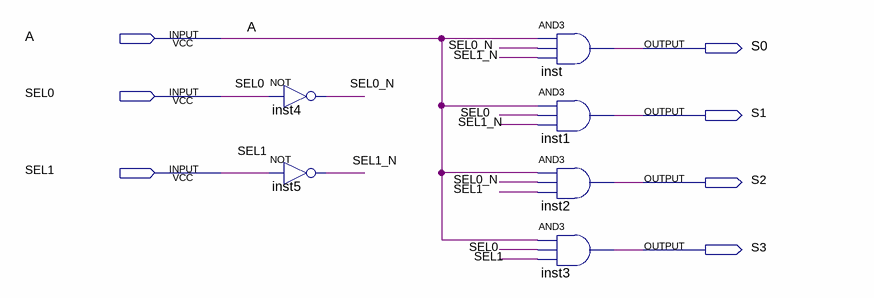
[diagram p0: schematic sheet]
// Quartus schematic tarea03_demux_4_a_1.bdf as structural Verilog: 6 symbols, 7 pins
module tarea03_demux_4_a_1 (
  input  A,
  input  SEL0,
  input  SEL1,
  output S0,
  output S1,
  output S2,
  output S3
);

  wire SEL0_N, SEL1_N;

  not inst4 (SEL0_N, SEL0);
  not inst5 (SEL1_N, SEL1);
  and inst (S0, A, SEL0_N, SEL1_N);
  and inst1 (S1, A, SEL0, SEL1_N);
  and inst2 (S2, A, SEL0_N, SEL1);
  and inst3 (S3, A, SEL0, SEL1);
endmodule
